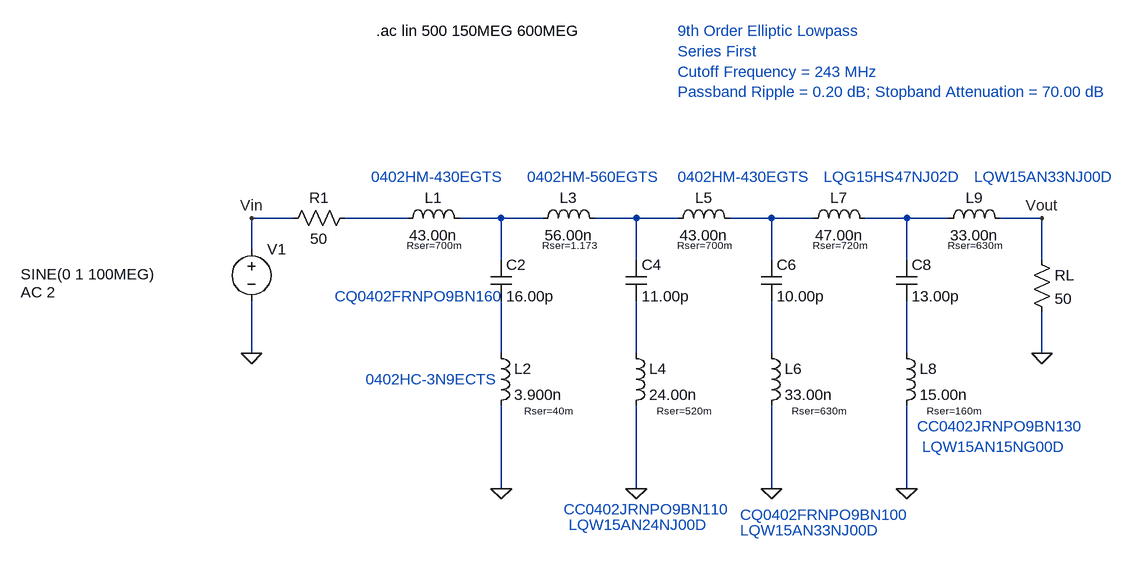
[diagram p0: schematic filter_9th-order.asc]
filter_9th-order.asc, the LTspice schematic file:
Version 4
SHEET 1 1200 528
WIRE -112 0 -176 0
WIRE 64 0 -32 0
WIRE 208 0 144 0
WIRE 272 0 208 0
WIRE 416 0 352 0
WIRE 480 0 416 0
WIRE 624 0 560 0
WIRE 688 0 624 0
WIRE 832 0 768 0
WIRE 896 0 832 0
WIRE 1040 0 976 0
WIRE -176 48 -176 0
WIRE 208 64 208 0
WIRE 416 64 416 0
WIRE 624 64 624 0
WIRE 832 64 832 0
WIRE 1040 64 1040 0
WIRE -176 208 -176 128
WIRE 208 208 208 128
WIRE 416 208 416 128
WIRE 624 208 624 128
WIRE 832 208 832 128
WIRE 1040 208 1040 144
WIRE 208 416 208 288
WIRE 416 416 416 288
WIRE 624 416 624 288
WIRE 832 416 832 288
FLAG -176 0 Vin
FLAG -176 208 0
FLAG 208 416 0
FLAG 416 416 0
FLAG 624 416 0
FLAG 832 416 0
FLAG 1040 208 0
FLAG 1040 0 Vout
SYMBOL voltage -176 32 R0
WINDOW 123 -355 82 Left 2
WINDOW 39 39 77 Left 2
WINDOW 3 -355 54 Left 2
SYMATTR Value2 AC 2
SYMATTR Value SINE(0 1 100MEG)
SYMATTR InstName V1
SYMBOL ind 48 16 R270
WINDOW 0 32 56 VTop 2
WINDOW 3 5 56 VBottom 2
WINDOW 39 -36 57 VTop 1
SYMATTR InstName L1
SYMATTR Value 43.00n
SYMATTR SpiceLine Rser=700m
SYMBOL cap 192 64 R0
SYMATTR InstName C2
SYMATTR Value 16.00p
SYMBOL ind 192 192 R0
WINDOW 39 89 94 Top 1
SYMATTR SpiceLine Rser=40m
SYMATTR InstName L2
SYMATTR Value 3.900n
SYMBOL ind 256 16 R270
WINDOW 0 32 56 VTop 2
WINDOW 3 5 56 VBottom 2
WINDOW 39 -36 57 VTop 1
SYMATTR InstName L3
SYMATTR Value 56.00n
SYMATTR SpiceLine Rser=1.173
SYMBOL cap 400 64 R0
SYMATTR InstName C4
SYMATTR Value 11.00p
SYMBOL ind 400 192 R0
WINDOW 39 89 94 Top 1
SYMATTR SpiceLine Rser=520m
SYMATTR InstName L4
SYMATTR Value 24.00n
SYMBOL ind 464 16 R270
WINDOW 0 32 56 VTop 2
WINDOW 3 5 56 VBottom 2
WINDOW 39 -36 57 VTop 1
SYMATTR InstName L5
SYMATTR Value 43.00n
SYMATTR SpiceLine Rser=700m
SYMBOL cap 608 64 R0
SYMATTR InstName C6
SYMATTR Value 10.00p
SYMBOL ind 608 192 R0
WINDOW 39 89 94 Top 1
SYMATTR SpiceLine Rser=630m
SYMATTR InstName L6
SYMATTR Value 33.00n
SYMBOL ind 672 16 R270
WINDOW 0 32 56 VTop 2
WINDOW 3 5 56 VBottom 2
WINDOW 39 -36 57 VTop 1
SYMATTR InstName L7
SYMATTR Value 47.00n
SYMATTR SpiceLine Rser=720m
SYMBOL cap 816 64 R0
SYMATTR InstName C8
SYMATTR Value 13.00p
SYMBOL ind 816 192 R0
WINDOW 39 89 94 Top 1
SYMATTR SpiceLine Rser=160m
SYMATTR InstName L8
SYMATTR Value 15.00n
SYMBOL ind 880 16 R270
WINDOW 0 32 56 VTop 2
WINDOW 3 5 56 VBottom 2
WINDOW 39 -36 57 VTop 1
SYMATTR InstName L9
SYMATTR Value 33.00n
SYMATTR SpiceLine Rser=630m
SYMBOL res 1024 48 R0
SYMATTR InstName RL
SYMATTR Value 50
SYMBOL res -16 -16 R90
WINDOW 0 0 56 VBottom 2
WINDOW 3 32 56 VTop 2
SYMATTR InstName R1
SYMATTR Value 50
TEXT 16 -288 Left 2 !.ac lin 500 150MEG 600MEG
TEXT 480 -288 Left 2 ;9th Order Elliptic Lowpass\nSeries First\nCutoff Frequency = 243 MHz\nPassband Ripple = 0.20 dB; Stopband Attenuation = 70.00 dB
TEXT 0 248 Left 2 ;0402HC-3N9ECTS
TEXT 8 -64 Left 2 ;0402HM-430EGTS
TEXT 248 -64 Left 2 ;0402HM-560EGTS
TEXT 480 -64 Left 2 ;0402HM-430EGTS
TEXT 704 -64 Left 2 ;LQG15HS47NJ02D
TEXT 576 480 Left 2 ;LQW15AN33NJ00D
TEXT 312 472 Left 2 ;LQW15AN24NJ00D
TEXT 936 -64 Left 2 ;LQW15AN33NJ00D
TEXT 856 352 Left 2 ;LQW15AN15NG00D
TEXT -48 120 Left 2 ;CQ0402FRNPO9BN160
TEXT 576 456 Left 2 ;CQ0402FRNPO9BN100
TEXT 304 448 Left 2 ;CC0402JRNPO9BN110
TEXT 848 320 Left 2 ;CC0402JRNPO9BN130

The netlist it stands for:
* filter_9th-order.asc
V1 Vin 0 SINE(0 1 100MEG) AC 2
L1 N001 N002 43.00n Rser=700m
C2 N002 N006 16.00p
L2 N006 0 3.900n Rser=40m
L3 N002 N003 56.00n Rser=1.173
C4 N003 N007 11.00p
L4 N007 0 24.00n Rser=520m
L5 N003 N004 43.00n Rser=700m
C6 N004 N008 10.00p
L6 N008 0 33.00n Rser=630m
L7 N004 N005 47.00n Rser=720m
C8 N005 N009 13.00p
L8 N009 0 15.00n Rser=160m
L9 N005 Vout 33.00n Rser=630m
RL Vout 0 50
R1 N001 Vin 50
.ac lin 500 150MEG 600MEG
* 9th Order Elliptic Lowpass
* Series First
* Cutoff Frequency = 243 MHz
* Passband Ripple = 0.20 dB; Stopband Attenuation = 70.00 dB
* 0402HC-3N9ECTS
* 0402HM-430EGTS
* 0402HM-560EGTS
* 0402HM-430EGTS
* LQG15HS47NJ02D
* LQW15AN33NJ00D
* LQW15AN24NJ00D
* LQW15AN33NJ00D
* LQW15AN15NG00D
* CQ0402FRNPO9BN160
* CQ0402FRNPO9BN100
* CC0402JRNPO9BN110
* CC0402JRNPO9BN130
.backanno
.end